# Altium schematic sheet AnalyzerEMG.SchDoc
size A4
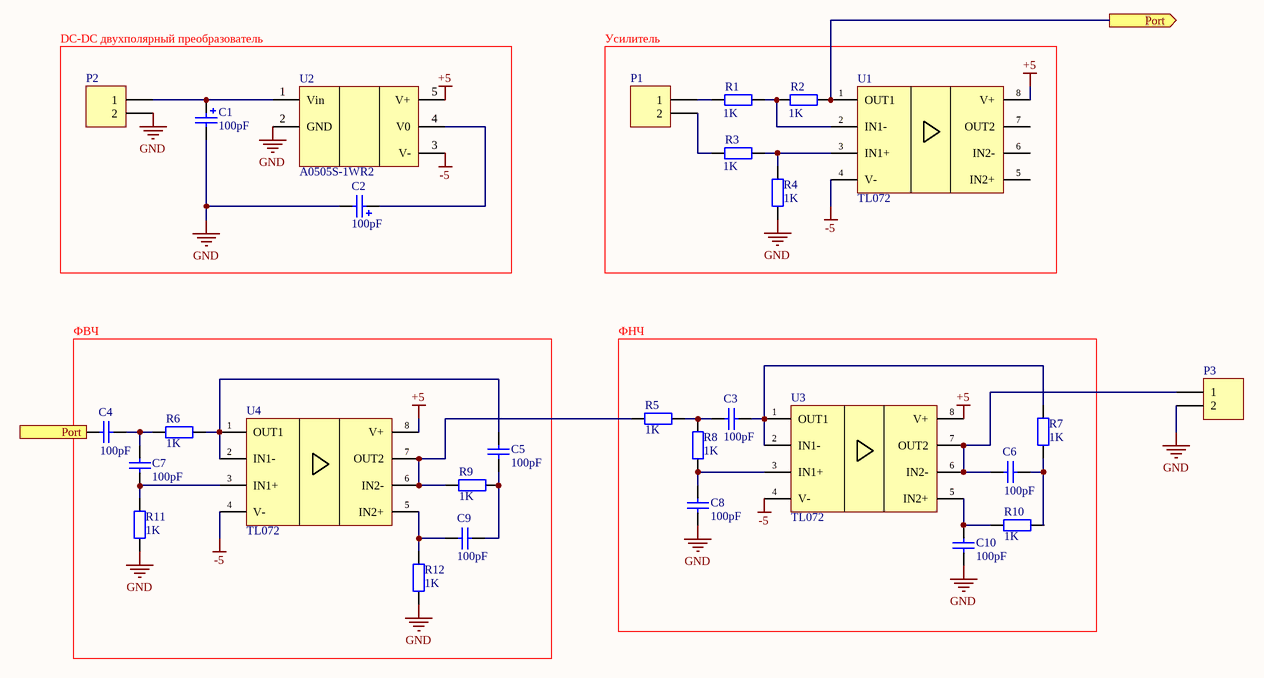
[diagram p0: AnalyzerEMG.SchDoc]

## Parts
C1  value 100pF  [C1206]  (hidden comment: Cap Pol2)
C2  value 100pF  [C1206]  (hidden comment: Cap Pol2)
C3  value 100pF  [C1206]  (hidden comment: Cap)
C4  value 100pF  [C1206]  (hidden comment: Cap)
C5  value 100pF  [C1206]  (hidden comment: Cap)
C6  value 100pF  [C1206]  (hidden comment: Cap)
C7  value 100pF  [C1206]  (hidden comment: Cap)
C8  value 100pF  [C1206]  (hidden comment: Cap)
C9  value 100pF  [C1206]  (hidden comment: Cap)
C10  value 100pF  [C1206]  (hidden comment: Cap)
P1  Header 2  [HDR1X2]  (value not drawn)
P2  Header 2  [HDR1X2]  (value not drawn)
P3  Header 2  [HDR1X2]  (value not drawn)
R1  value 1K  [C1206]  (hidden comment: Res2)
R2  value 1K  [C1206]  (hidden comment: Res2)
R3  value 1K  [C1206]  (hidden comment: Res2)
R4  value 1K  [C1206]  (hidden comment: Res2)
R5  value 1K  [C1206]  (hidden comment: Res2)
R6  value 1K  [C1206]  (hidden comment: Res2)
R7  value 1K  [C1206]  (hidden comment: Res2)
R8  value 1K  [C1206]  (hidden comment: Res2)
R9  value 1K  [C1206]  (hidden comment: Res2)
R10  value 1K  [C1206]  (hidden comment: Res2)
R11  value 1K  [C1206]  (hidden comment: Res2)
R12  value 1K  [C1206]  (hidden comment: Res2)
U1  TL072  [TL072]
U2  A0505S-1WR2  [A0505S-1WR2]
U3  TL072  [TL072]
U4  TL072  [TL072]

## Blocks framed on the sheet
DC-DC двухполярный преобразователь: C1 C2 P2 U2
Усилитель: P1 R1-R4 U1
ФВЧ: C4 C5 C7 C9 R6 R9 R11 R12 U4
ФНЧ: C3 C6 C8 C10 R5 R7 R8 R10 U3

## Ports
Port (in), Port (out)

## Nets
+5: U1.8(V+) U2.5(V+) U3.8(V+) U4.8(V+)
-5: U1.4(V-) U2.3(V-) U3.4(V-) U4.4(V-)
GND: C1.2 C2.2 C8.1 C10.1 P2.2 P3.2 R4.1 R11.1 R12.1 U2.2(GND)
Port: C4.1 R2.2 U1.1(OUT1) ; port Port
NetC1_1: C1.1 P2.1 U2.1(Vin)
NetC2_1: C2.1 U2.4(V0)
NetC3_1: C3.1 R7.2 U3.1(OUT1) U3.2(IN1-)
NetC3_2: C3.2 R5.2 R8.2
NetC4_2: C4.2 C7.2 R6.2
NetC5_1: C5.1 R6.1 U4.1(OUT1) U4.2(IN1-)
NetC5_2: C5.2 C9.2 R9.2
NetC6_1: C6.1 R7.1
NetC6_2: C6.2 P3.1 U3.6(IN2-) U3.7(OUT2)
NetC7_1: C7.1 R11.2 U4.3(IN1+)
NetC8_2: C8.2 R8.1 U3.3(IN1+)
NetC9_1: C9.1 R12.2 U4.5(IN2+)
NetC10_2: C10.2 R10.1 U3.5(IN2+)
NetP1_1: P1.1 R1.1
NetP1_2: P1.2 R3.1
NetR1_2: R1.2 R2.1 U1.2(IN1-)
NetR3_2: R3.2 R4.2 U1.3(IN1+)
NetR5_1: R5.1 R9.1 U4.6(IN2-) U4.7(OUT2)

Not connected (* = marked no-connect by the designer): R10 2; U1 5(IN2+) 6(IN2-) 7(OUT2)

## Library data of the parts
C1 C2 = Cap Pol2: Polarized Capacitor (Axial); Published: 8-Jun-2000; LatestRevisionDate: 17-Jul-2002; LatestRevisionNote: Re-released for DXP Platform.; PackageReference: POLAR0.8; Publisher: Altium Limited; PackageDescription: Polarized Capacitor; 2 Leads
C3-C10 = Cap: Capacitor; Published: 8-Jun-2000; LatestRevisionDate: 17-Jul-2002; LatestRevisionNote: Re-released for DXP Platform.; PackageReference: RAD-0.3; Publisher: Altium Limited; PackageDescription: Radial Cap, Thru-Hole; 2 Leads; 0.3 in Pin Spacing
P1-P3 = Header 2: Header, 2-Pin; LatestRevisionDate: 17-Jul-2002; LatestRevisionNote: Re-released for DXP Platform.; Publisher: Altium Limited
R1-R12 = Res2: Resistor; Published: 8-Jun-2000; LatestRevisionDate: 17-Jul-2002; LatestRevisionNote: Re-released for DXP Platform.; PackageReference: AXIAL-0.4; Publisher: Altium Limited; PackageDescription: Axial Device, Thru-Hole; 2 Leads; 0.4 in Pin Spacing